# EAGLE design bathroom_fan_power_supply (EAGLE 9.6.2)
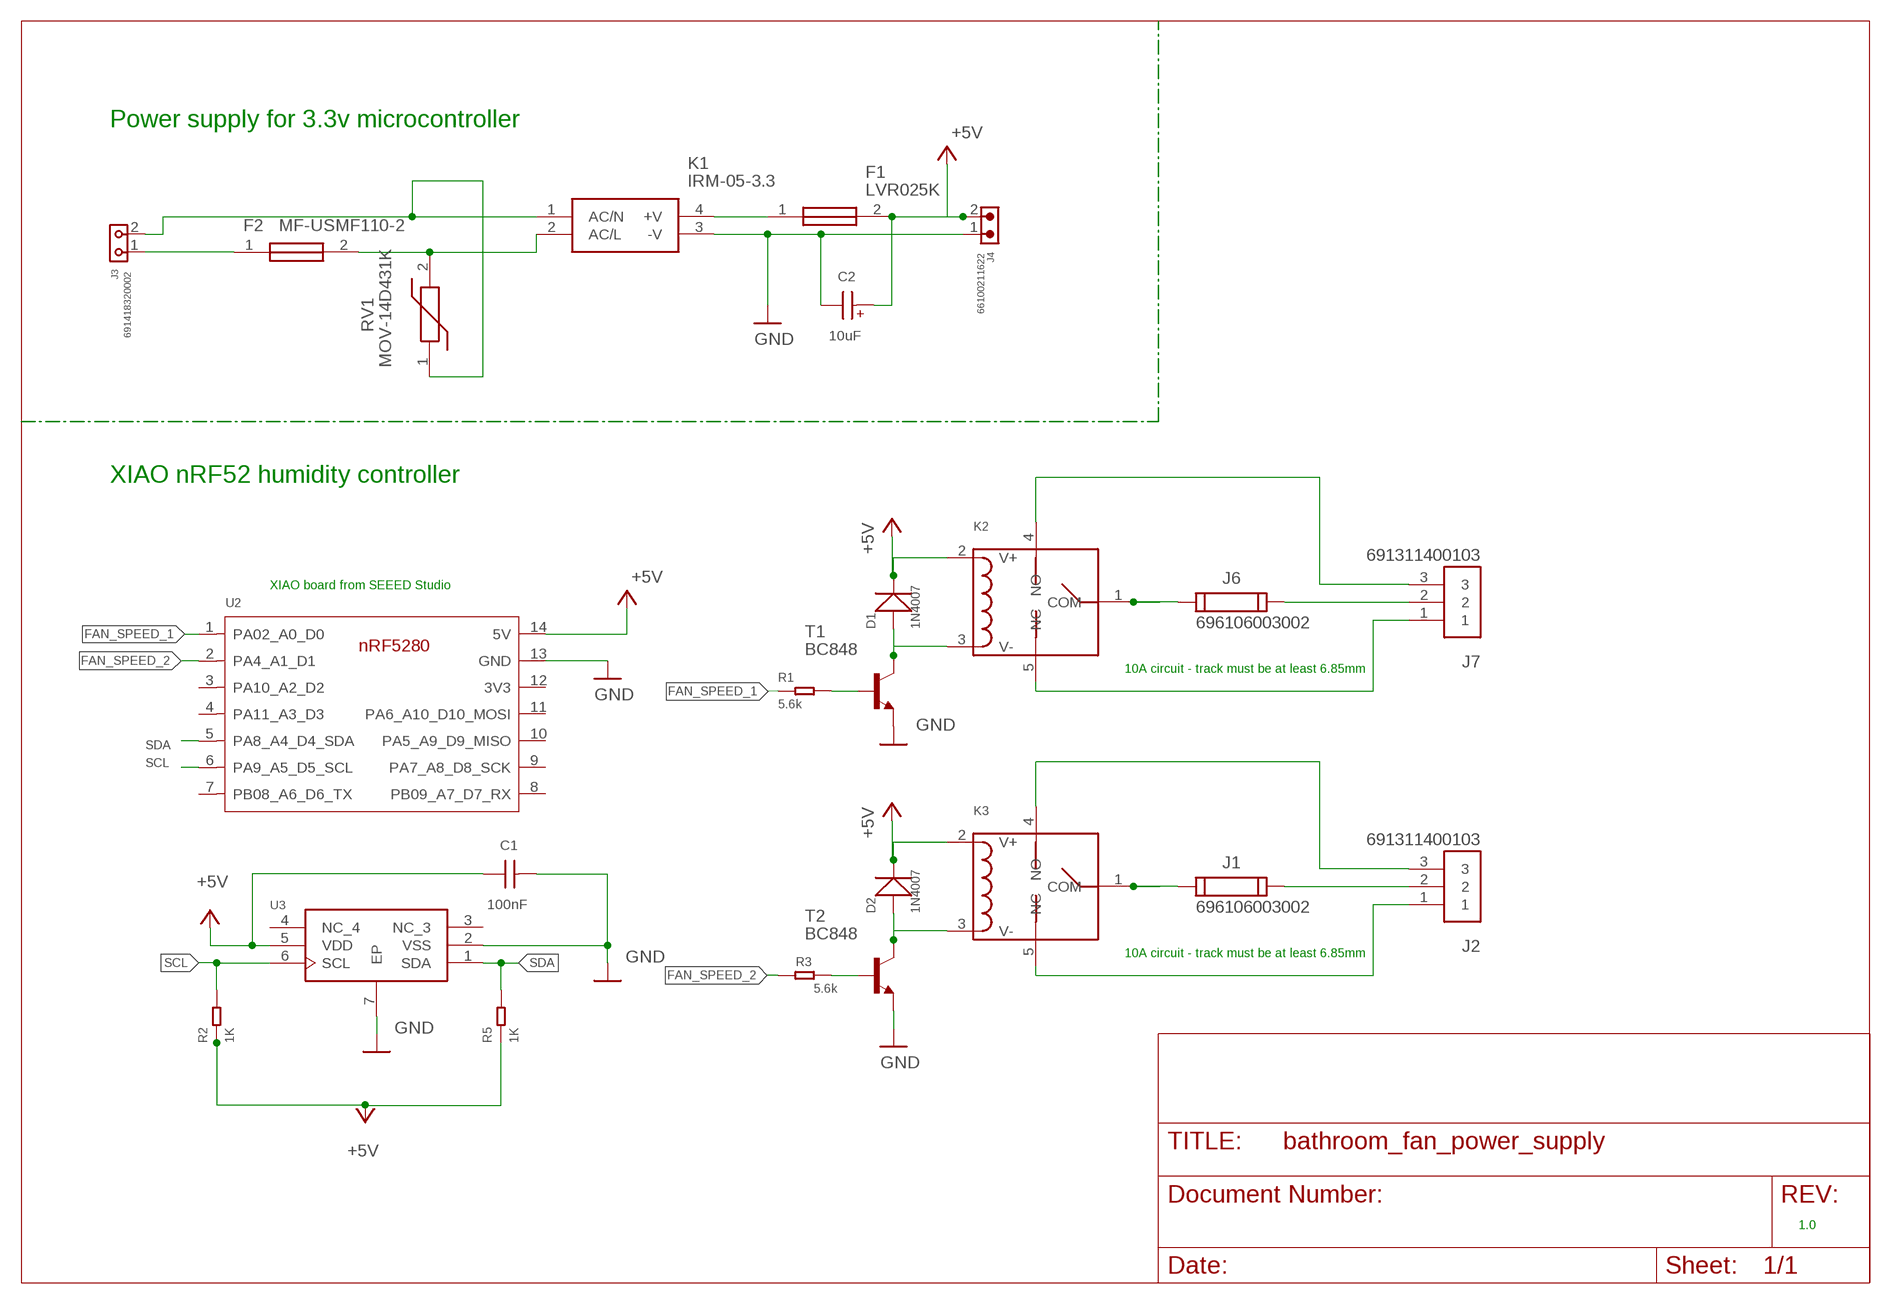
[diagram p0: schematic, sheet 1]

## Parts
C1  100nF  WCAP-CSGP_0805_H0.8_885012207016_10V(DC)_R  [WCAP-CSGP_0805_H0.8_R]
C2  10uF  WCAP-AS5H_4X5.5_865230340001  [WCAP-AS5H_4X5.5(DXL)]
D1  1N4007  DIODE-GEN-PURPOSE-1KV-1A(DO-214AC)  [DO-214AC]
D2  1N4007  DIODE-GEN-PURPOSE-1KV-1A(DO-214AC)  [DO-214AC]
F1  LVR025K  [LVR025K]
F2  MF-USMF110-2  [FUSC3226X85N]
J1  696106003002  [696106003002]
J2  691311400103  [TERMINALBLOCK_PLUGGABLE-3-7.62MM]
J3  691418320002  691418320002  [691418320002]
J4  66100211622  66100211622  [66100211622]
J6  696106003002  [696106003002]
J7  691311400103  [TERMINALBLOCK_PLUGGABLE-3-7.62MM]
K1  IRM-05-3.3  [IRM-05-3.3_1]
K2  HLS8L-DC3V-S-C  RELAY-HLS8L-DC5V-S-CHLS8L-DC5V-S-C  [REY5-19.0X15.0X15.0MM]
K3  HLS8L-DC3V-S-C  RELAY-HLS8L-DC5V-S-CHLS8L-DC5V-S-C  [REY5-19.0X15.0X15.0MM]
R1  5.6k  SMD-RES-5.6K-5%-1/8W(0805)  [R0805]
R2  1K  SMD-RES-5.6K-5%-1/8W(0805)  [R0805]
R3  5.6k  SMD-RES-5.6K-5%-1/8W(0805)  [R0805]
R5  1K  SMD-RES-5.6K-5%-1/8W(0805)  [R0805]
RV1  MOV-14D431K  [MOV-14D(5.2MM-T)]
T1  BC848  [SOT23]
T2  BC848  [SOT23]
U2  MOUDLE-SEEEDUINO-XIAO  [MOUDLE14P-2.54-21X17.8MM]
U3  SHT21  [6-TDFN]

## Nets
+5V: C1.1 C2.1(+) D1.2(-) D2.2(-) F1.2 J4.2 K2.2(V+) K3.2(V+) R2.1 R5.1 U2.14(5V) U3.5(VDD)
FAN_SPEED_1: R1.1 U2.1(PA02_A0_D0)
FAN_SPEED_2: R3.1 U2.2(PA4_A1_D1)
GND: C1.2 C2.2(-) J4.1 K1.3(-V) T1.2(E) T2.2(E) U2.13(GND) U3.2(VSS) U3.7(EP)
HIGHCURRENT1 [Power]: J1.1 K3.1(COM)
N$1: F2.2 K1.2(AC/L) RV1.2
N$2: F2.1 J3.1
N$3: F1.1 K1.4(+V)
N$4 [Power]: J6.1 K2.1(COM)
N$6: J3.2 K1.1(AC/N) RV1.1
N$7 [Power]: J6.2 J7.2
N$9: R1.2 T1.1(B)
N$11 [Power]: J7.1 K2.5(NC)
N$12 [Power]: J7.3 K2.4(NO)
N$14: D2.1(+) K3.3(V-) T2.3(C)
N$15: R3.2 T2.1(B)
N$16 [Power]: J2.1 K3.5(NC)
N$17 [Power]: J2.3 K3.4(NO)
N$18 [Power]: J1.2 J2.2
N$19: D1.1(+) K2.3(V-) T1.3(C)
SCL: R2.2 U2.6(PA9_A5_D5_SCL) U3.6(SCL)
SDA: R5.2 U2.5(PA8_A4_D4_SDA) U3.1(SDA)
Unconnected: U2.3(PA10_A2_D2) U2.4(PA11_A3_D3) U2.7(PB08_A6_D6_TX) U2.8(PB09_A7_D7_RX) U2.9(PA7_A8_D8_SCK) U2.10(PA5_A9_D9_MISO) U2.11(PA6_A10_D10_MOSI) U2.12(3V3) U3.3(NC_3) U3.4(NC_4)

## Notes on the sheet
- Power supply for 3.3v microcontroller
- XIAO nRF52 humidity controller
- XIAO board from SEEED Studio
- 10A circuit - track must be at least 6.85mm
- 10A circuit - track must be at least 6.85mm
- 1.0

## Library data of the parts
C1 = Wurth_Capacitors_WCAP-CSGP:WCAP-CSGP_0805_H0.8: WCAP-CSGP MLCCs 0805 Characteristics General purpose product series High performance ceramic High electrical precision and stability ceramic especially for NP0 Minimal aging especially for NP0 Mounting style: SMT-Chip Ceramic: NP0 (Class I), X5R (Class II), X7R (Class II) Temperature coefficient: ±30 ppm/°C; ±0.54 % for NP0 ±15 % for X5R and X7R Operating temperature: -55 °C up to + 125 °C for NP0 and X7R -55 °C up to + 85 °C for X5R Termination: Cu/Ni/Sn Recommended soldering: Reflow soldering Wave soldering for size 0603 Wave soldering for size 0805 (only valid for the thickness ≤0.85 mm) Applications Temperature compensation (NP0) Coupling Decoupling Bypass Smoothing Filtering Resonant circuit <https://www.we-online.com/catalog/media/o177837v209%20MLCC_GRP_all.jpg> Details see: https://www.we-online.com/catalog/en/pbs/capacitors/multilayer_ceramic_chip_capacitors/mlcc_general_purpose Updated by Ella Wu 2022-02-15 2022(C) Würth Elektronik; CERAMIC-TYPE: X7R Class II; DATASHEET-URL: https://www.we-online.com/redexpert/spec/885012207016?ae; DF: 5%; HEIGHT: 0.8mm; MOUNT: SMT; OPERATING-TEMPERATURE: -55 up to +125 °C; PART-NUMBER: 885012207016; QMIN: -; RISO: 5GOhm; SIZE: 0805; TECHNICAL-REFERENCE: X7R0805104K010DFCT10000; VR: 10V(DC)
C2 = Wurth_Capacitors_WCAP-AS5H:WCAP-AS5H_4X5.5: WCAP-AS5H Aluminium Electrolytic Capacitors Long Life +105 °C Characteristics Long life product series Mounting style: V-Chip SMT Capacitance range: 0.1 µF ‒ 1000 µF Capacitance tolerance: ±20 % Voltage range (UR): 6.3 ‒ 50 V(DC) Operating temperature: -40 °C up to +105 °C Endurance: 5000 h @ +105 °C Dimensions (DxL) in mm: 4.0 x 5.5 up to 10.0 x 10.5 Recommended soldering: Reflow soldering Applications Long life applications (industry, medical) Input and output capacitor for switched-mode power supply Filtering Smoothing e.g. DC/DC converter, AC/DC converter, satellite receiver, control panel <https://www.we-online.com/catalog/media/o55801v209%20Family_WCAP-AS5H.jpg> Details see: www.we-online.com/catalog/WCAP-AS5H <www.we-online.com/catalog/WCAP-AS5H/?utm_source=eagle_model&utm_medium=description_link&utm_campaign=eisos_eagle> Updated by Ella Wu 2022-07-27 2022(C) Würth Elektronik; DATASHEET-URL: https://www.we-online.com/redexpert/spec/865230340001?ae; DF: 22%; DIAMETER: 4mm; ENDURANCE: 5000h; HEIGHT: 5.5mm; I-LEAK: 3uA; I-RIPPLE: 17mA; OPERATING-TEMPERATURE: -40 °C up to +105 °C; PART-NUMBER: 865230340001; TECHNICAL-REFERENCE: ASDB055100M016DVCTAE000; VR: 16V(DC)
D1 D2 = OPL_Discrete_Semiconductor:DIODE-GEN-PURPOSE-1KV-1A(DO-214AC): 304010013; MPN: 1N4007
F1 = LVR025K:LVR025K: Fuse,resettable,PolySwitch,thermal and overcurrent protection,PCB mount,240Vac,250mA Source: Datasheet <https://componentsearchengine.com/Datasheets/1/LVR025K.pdf>; ARROW_PART_NUMBER: LVR025K; ARROW_PRICE-STOCK: https://www.arrow.com/en/products/lvr025k/littelfuse?region=europe; DESCRIPTION: Fuse,resettable,PolySwitch,thermal and overcurrent protection,PCB mount,240Vac,250mA; HEIGHT: 18.8mm; MANUFACTURER_NAME: LITTELFUSE; MANUFACTURER_PART_NUMBER: LVR025K; MOUSER_PART_NUMBER: 650-LVR025K; MOUSER_PRICE-STOCK: https://www.mouser.co.uk/ProductDetail/Littelfuse/LVR025K?qs=UrbseFuNL0k%252BoDJit06JJg%3D%3D
F2 = MF-USMF110-2:MF-USMF110-2: Bourns 1.1A Surface Mount Resettable Fuse, 6 V Source: Datasheet <https://www.arrow.com/en/products/mf-usmf110-2/bourns>; ARROW_PART_NUMBER: MF-USMF110-2; ARROW_PRICE-STOCK: https://www.arrow.com/en/products/mf-usmf110-2/bourns; DESCRIPTION: Bourns 1.1A Surface Mount Resettable Fuse, 6 V; HEIGHT: 0.85mm; MANUFACTURER_NAME: Bourns; MANUFACTURER_PART_NUMBER: MF-USMF110-2; MOUSER_PART_NUMBER: 652-MF-USMF110-2; MOUSER_PRICE-STOCK: https://www.mouser.co.uk/ProductDetail/Bourns/MF-USMF110-2?qs=9FzDyaD7ZFDRIi%252Bgh%252BHt3w%3D%3D
J1 J6 = Wurth_Connectors_WR-FSH:696106003002: WR-FSH Fuseholder THT Blocks PCB Clip Cover MATERIAL PROPERTIES Insulator Material PA66 Insulator Flammability Rating UL94 V-0 Insulator Color Green Contact Material Copper Alloy Contact Plating Tin over Nickel Contact Type Stamped GENERAL INFORMATION Operating Temperature -30 up to +120 °C Compliance RoHS ELECTRICAL PROPERTIES IR UL 20 A IR VDE 6.3 A Working Voltage [UL] 250 V (AC) Working Voltage [VDE] 250 V (AC) Withstanding Voltage [UL] 1500 V (AC) Withstanding Voltage [cULus] 1500 V (AC) Withstanding Voltage [VDE] 1500 V (AC) Contact Resistance 10 mΩ Contact Resistance [VDE] 10 mΩ MECHANICAL PROPERTIES Protection Class I & II Fuse Size 5x20 mm CERTIFICATION cULus Approval E157417 VDE Approval 129302 PACKAGING PROPERTIES Packaging Box <https://katalog.we-online.com/media/images/v2/o33102v209%20Family_WR-FSH_69610X003002.jpg> Details see: https://katalog.we-online.com/en/em/FSH_THT_PCB_CLIP_COVER_69610X003002 Updated by Ella Wu 2019-10-25 2019 (C) Wurth Elektronik; DATASHEET-URL: https://www.we-online.com/catalog/datasheet/696106003002.pdf; IR-UL: 20A; IR-VDE: 6.3A; MATES: 696122003001; PART-NUMBER: 696106003002
J2 J7 = Terminal Blocks:691311400103: 7.62MM CLOSE VERTICAL PCB HEADER WR-TBL Manufacturer's datasheet <https://katalog.we-online.com/em/datasheet/6913114001xx.pdf>; CREATED_BY: PCBLayout.com; DIGIKEY_PART_NO: 732-2824-ND; MANUFACTURER: WURTH ELEKTRONIK; MPN: 691311400103
J3 = Wurth_Connectors_WR-TBL Spring Clamp:691418320002: WR-TBL Serie 4183 - 3.81 mm 45° Cable Entry Screwless KIND PROPERTIES Pitch 3.81 mm MATERIAL PROPERTIES Insulator Material PA6/66 Insulator Flammability Rating UL94 V-0 Insulator Color Grey Contact Material Phosphor Bronze Contact Plating Matte Tin Wire Guard Material Phosphor Bronze GENERAL INFORMATION Operating Temperature -30 up to +120 °C Compliance Lead free / RoHS ELECTRICAL PROPERTIES IR UL 4 A IR VDE 4 A Working Voltage [UL] 300 V (AC) Working Voltage [VDE] 250 V (AC) Withstanding Voltage [UL] 1600 V (AC) Withstanding Voltage [VDE] 2000 V (AC) Contact Resistance 20 mΩ Mechanical Properties Wire Strip Length 7 (mm) Wire Properties Solid Wire Section (AWG) 16 to 30 (AWG) Solid Wire Section (Metric) 1.31 to 0.0509 (mm²) Stranded Wire Section (AWG) 16 to 30 (AWG) Stranded Wire Section (Metric) 1.31 to 0.0509 (mm²) CERTIFICATION UL Approval E150931 VDE Approval 40013441 Packaging Properties Packaging Box <https://www.we-online.com/catalog/media/o79471v209%20Family_WR-TBL_6914173200xxS_4C.jpg> Details see: https://www.we-online.com/catalog/en/TBL_3_81_4183_SCREWLESS_ANGLED_ENTRY_6914183200XX/ Updated by Ella Wu 2019-12-31 2019(C) Wurth Elektronik; DATASHEET-URL: https://www.we-online.com/catalog/datasheet/691418320002.pdf; IR-UL: 4A; IR-VDE: 4A; MOUNT: THT; PART-NUMBER: 691418320002; PINS: 2; PITCH: 3.81mm; TYPE: 45°; WIRE: 16 to 30 (AWG) 1.31 to 0.0509 (mm²); WORKING-VOLTAGE-UL: 300V (AC); WORKING-VOLTAGE-VDE: 250V (AC)
J4 = Wurth_Connectors_WR-WTB:66100211622: WR-WTB 2.54 mm Male Vertical Shrouded Header KIND PROPERTIES: Pitch:2.54 mm Gender:Male MATERIAL PROPERTIES: Insulator Material :PA46 Insulator Flammability Rating:UL94 V-0 Color:Black Contact Material:Phosphor Bronze Contact Plating:Tin GENERAL INFORMATION Operating Temperature:-40 up to +105 °C Compliance: RoHS Working Voltage:50 V (AC) Withstanding Voltage:500 V (AC) Contact Resistance:20 mΩ PACKAGING PROPERTIES Packaging:Box <https://katalog.we-online.com/media/images/v2/o58903v209%20Family_WR-WTB_6610xx11622_2%2054.jpg> Details see: https://katalog.we-online.com/en/em/WTB_2_54_MALE_VERTICAL_SHROUDED_HEADER_GLOW_WIRE_PLASTIC_6610XXX1622 Updated by Yingchun,Shan 2019-11-05 2019 (C) Würth Elektronik; CONTACT-RESISTANCE: 20mOhm; DATASHEET-URL: https://www.we-online.com/catalog/datasheet/66100211622.pdf; GENDER: Male; IR: 3A; L: 4.78mm; MOUNT: THT; PACKAGING: Box; PART-NUMBER: 66100211622; PCB-CABLE-PANEL: PCB; PINS: 2; PITCH: 2.54mm; TOL-R: max.; TYPE: Vertical; WORKING-VOLTAGE: 50V(AC)
K1 = IRM-05-3.3:IRM-05-3.3: AC/DC Power Modules 3.3V 1.25A 4.125W 85-264Vin Encap PS Source: Datasheet <https://www.meanwell-web.com/content/files/pdfs/productPdfs/MW/IRM-05-spec.pdf>; ARROW_PART_NUMBER: IRM-05-3.3; ARROW_PRICE-STOCK: https://www.arrow.com/en/products/irm-05-3.3/mean-well-enterprises?region=nac; DESCRIPTION: AC/DC Power Modules 3.3V 1.25A 4.125W 85-264Vin Encap PS; HEIGHT: mm; MANUFACTURER_NAME: Mean Well; MANUFACTURER_PART_NUMBER: IRM-05-3.3; MOUSER_PART_NUMBER: 709-IRM05-3.3; MOUSER_PRICE-STOCK: https://www.mouser.co.uk/ProductDetail/MEAN-WELL/IRM-05-3.3?qs=WkdRfq4wf1MOEinwvhZEjA%3D%3D
K2 K3 = OPL_Relay:RELAY-HLS8L-DC5V-S-C: 315030000
R1 R3 = OPL_Resistor:SMD-RES-5.6K-5%-1/8W(0805): 301012204; MPN: RC0805JR-071KL; VALUE: 1K
R2 R5 = OPL_Resistor:SMD-RES-5.6K-5%-1/8W(0805): 301012204; MPN: RC0805JR-071KL
RV1 = MOV-14D431K:MOV-14D431K: Varistor;Metal Oxide;14 mm;430V;10% Bourns MOV-14D Series Metal Oxide Varistor 460pF 50A 710V Source: Datasheet <https://componentsearchengine.com/Datasheets/1/MOV-14D431K.pdf>; ARROW_PART_NUMBER: MOV-14D431K; ARROW_PRICE-STOCK: https://www.arrow.com/en/products/mov-14d431k/bourns; DESCRIPTION: Varistor;Metal Oxide;14 mm;430V;10% Bourns MOV-14D Series Metal Oxide Varistor 460pF 50A 710V; HEIGHT: mm; MANUFACTURER_NAME: Bourns; MANUFACTURER_PART_NUMBER: MOV-14D431K; MOUSER_PART_NUMBER: 652-MOV-14D431K; MOUSER_PRICE-STOCK: https://www.mouser.co.uk/ProductDetail/Bourns/MOV-14D431K?qs=CQ3B1E%252BbPs0oqNHNiUHWVg%3D%3D
T1 T2 = transistor-neu-to92:BC848: NPN TRANSISTOR
U2 = XIAO nRF52840:MOUDLE-SEEEDUINO-XIAO
U3 = Sensor:SHT21: SENSOR HUMID/TEMP 3V I2C 2% SMD Manufacturer's datasheet <https://www.sensirion.com/fileadmin/user_upload/customers/sensirion/Dokumente/0_Datasheets/Humidity/Sensirion_Humidity_Sensors_SHT21_Datasheet.pdf>; CREATED_BY: PCBLayout.com; DIGIKEY_PART_NUMBER: 1649-1005-1-ND; MANUFACTURER: Sensirion AG; MPN: SHT21; PACKAGE: 6-TDFN

## Net classes
1 Power: width 0.007 mm

## Board
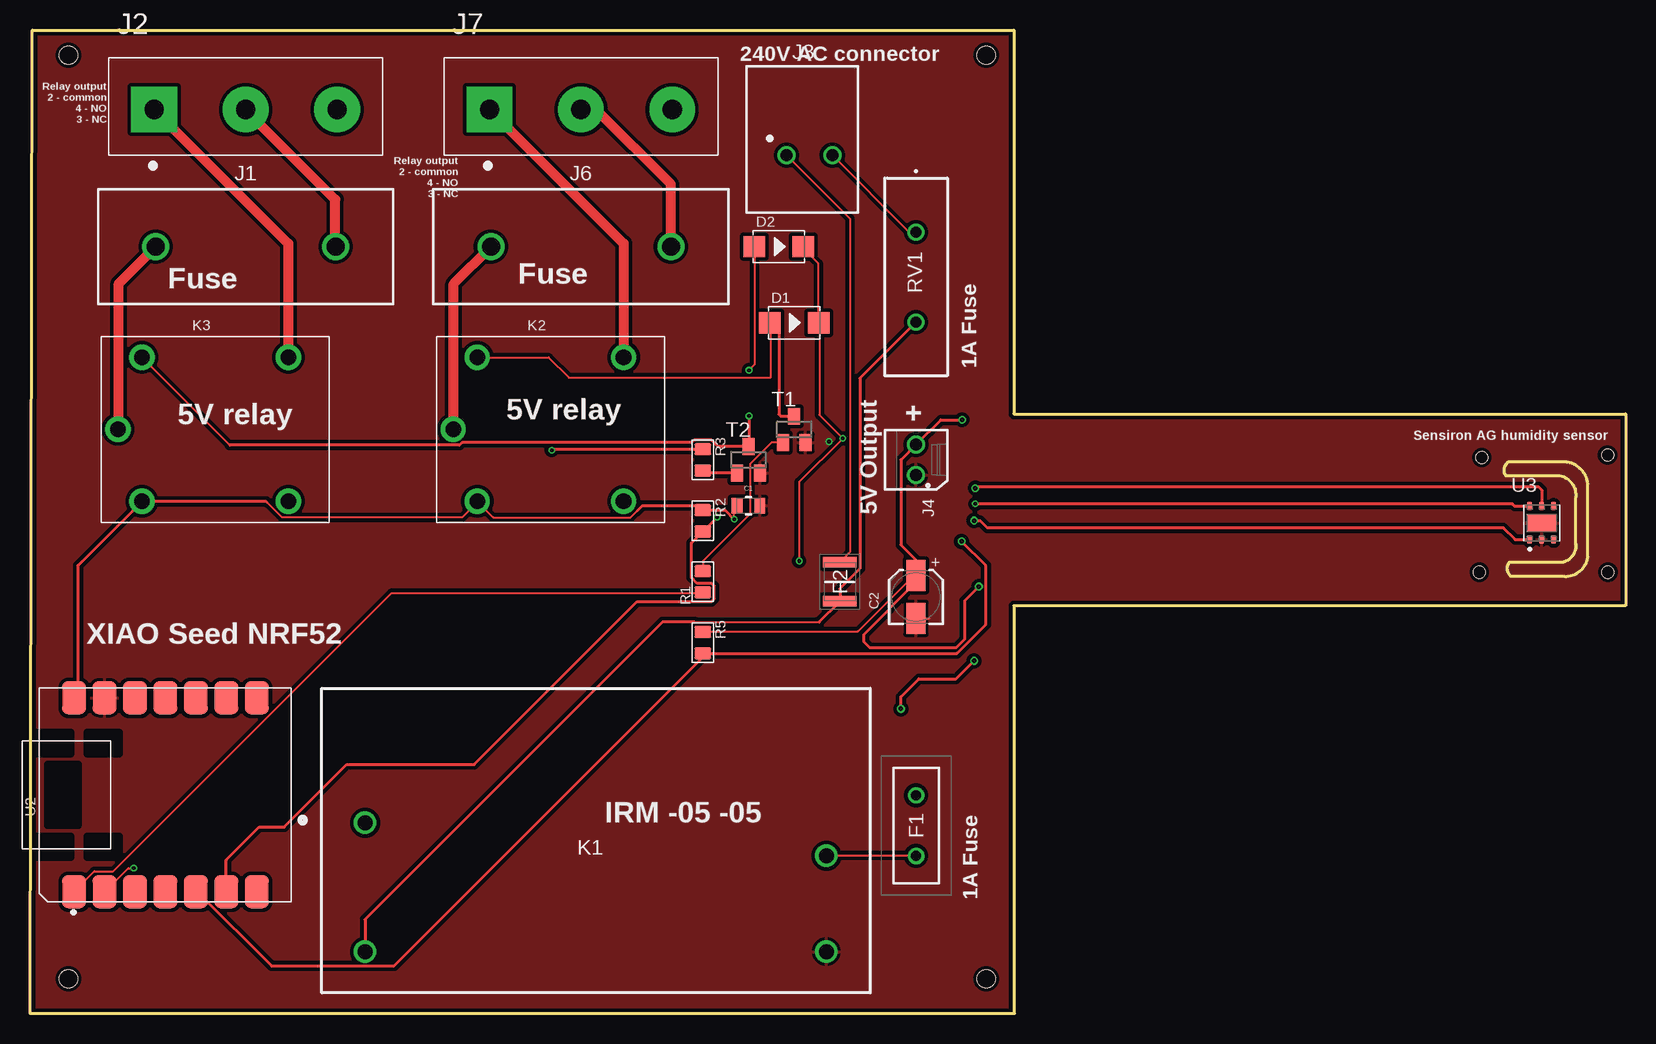
[diagram p1: board, top side]
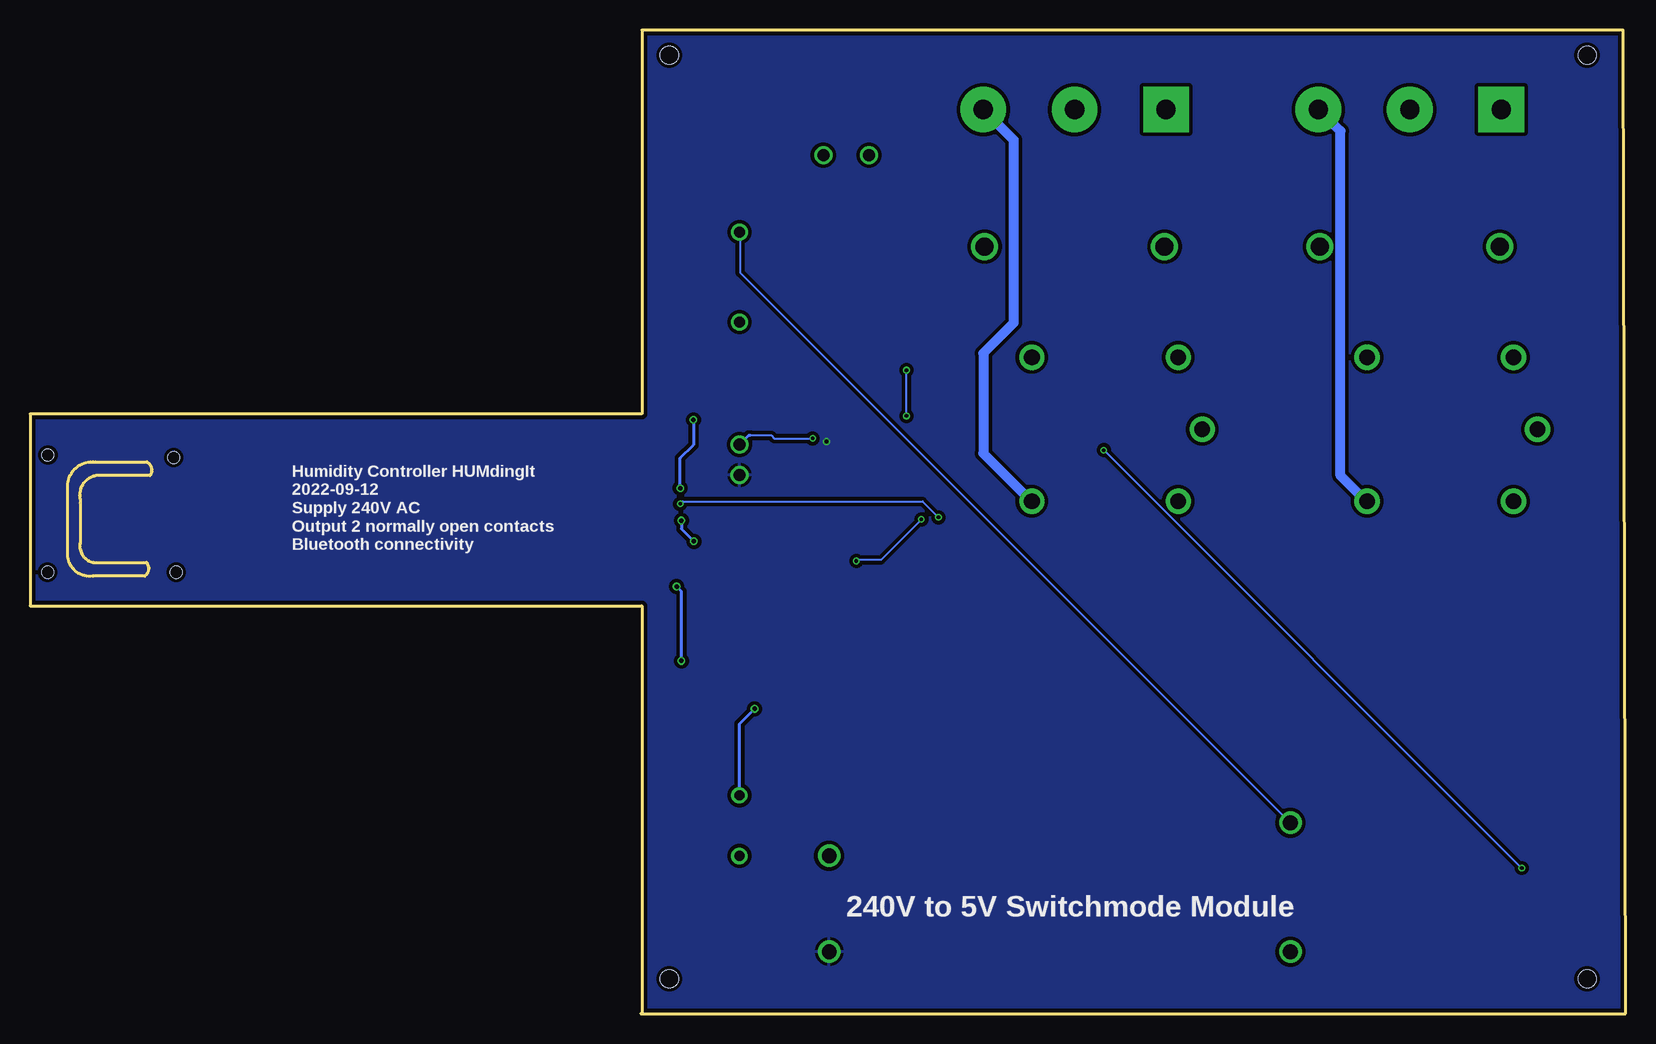
[diagram p2: board, bottom side, seen from below]

Size 133 x 82 mm. Coordinates in mm from the lower left corner, seen from the top.
Outline: 0,0 0.2,82 82,82 82,50 133,50 133,34 82,34 82,0.1 82.1,0 0,0
Copper layers (1*16): Top 0.035mm / dielectric 1.5mm / Bottom 0.035mm
Design rules "SparkFun-2-Layer-Minimum-JLCPCB": minimum track width 5mil, minimum drill 0.3mm, track to track 5mil, track to pad 5mil, pad to pad 5mil, via to via 5mil, smd to smd 5mil, copper to edge 7mil, drill to drill 7mil, minimum pad ring 5mil, minimum via ring 5mil, stop-mask expansion 2.5mil, vias tented up to drill 25mil, thermal gap 10mil
Holes 1.5 mm at 3.2,79.9 79.7,79.9 3.2,2.9 79.7,2.9
Holes 1 mm at 121.02,46.36 120.82,36.79 131.53,36.79 131.51,46.57
Milling: 13 lines

### Footprints (pad centres in the part's own frame; a part is rotated, then mirrored left to right if it is on the bottom)
WCAP-CSGP_0805_H0.8_R = smd 0.9 x 1.3: 1 -0.95,0; 2 0.95,0
WCAP-AS5H_4X5.5(DXL) = smd 2.6 x 1.6: 1 1.8,0; 2 -1.8,0
DO-214AC = smd 1.8 x 1.77: 1 -2.042,0; 2 2.042,0
LVR025K = drill 0.84 pad 1.365: 1 0,0; 2 5.05,0
FUSC3226X85N = smd 0.88 x 2.81: 1 -1.635,0; 2 1.635,0
696106003002 = drill 1.5: 1 -7.5,0; 2 7.5,0
TERMINALBLOCK_PLUGGABLE-3-7.62MM = drill 1.6 pad 3.81 square: 1 -7.62,0 | drill 1.6 pad 3.81: 2 0,0; 3 7.62,0
691418320002 = drill 1: 1 -1.905,0; 2 1.905,0
66100211622 = drill 1: 1 1.27,0; 2 -1.27,0
IRM-05-3.3_1 = drill 1.24 pad 1.89: 1 3.6,14.2; 2 3.6,3.45; 3 42.05,3.45; 4 42.05,11.45
REY5-19.0X15.0X15.0MM = drill 1.3 pad 2.1: 1 -8.1,0; 2 -6.1,-6; 3 -6.1,6; 4 6.1,-6; 5 6.1,6
R0805 = smd 1.397 x 1.016: 1 0,0.889; 2 0,-0.889
MOV-14D(5.2MM-T) = drill 0.9 pad 1.4: 1 -3.75,0; 2 3.75,0
SOT23 = smd 1 x 1.4: 1 -0.95,-1.1; 2 0.95,-1.1; 3 0,1.1
MOUDLE14P-2.54-21X17.8MM = smd 2.75 x 2: 1 0.835,18.12; 2 0.835,15.58; 3 0.835,13.04; 4 0.835,10.5; 5 0.835,7.96; 6 0.835,5.42; 7 0.835,2.88; 8 17,2.88; 9 17,5.42; 10 17,7.96; 11 17,10.5; 12 17,13.04; 13 17,15.58; 14 17,18.12
6-TDFN = smd 0.43 x 0.71: 1 -1,-1.4; 2 0,-1.4; 3 1,-1.4; 4 1,1.4; 5 0,1.4; 6 -1,1.4 | smd 2.4 x 1.5: 7 0,0

### Placement (x,y rotation side)
C1  59.89,42.35 0 top
C2  73.86,34.73 90 top
D1  63.7,57.59 0 top
D2  62.43,63.94 0 top
F1  73.86,13.14 90 top
F2  67.51,36 270 top
J1  17.98,63.94 0 top
J2  17.98,75.37 0 top
J3  64.97,71.56 0 top
J4  73.86,46.16 270 top
J6  45.92,63.94 0 top
J7  45.92,75.37 0 top
K1  24.33,1.71 0 top
K2  43.38,48.7 0 top
K3  15.44,48.7 0 top
R1  56.08,36 180 top
R2  56.08,41.08 0 top
R3  56.08,46.16 0 top
R5  56.08,30.92 0 top
RV1  73.86,61.4 270 top
T1  63.7,48.7 0 top
T2  59.89,46.16 0 top
U2  21.79,9.33 90 top
U3  126.01,40.91 0 top

### Tracks (layer width: path | path; a pad name or v marks a point on that pad's centre or on a via)
+5V  (via drill 0.3, 0.38)
  Top 0.178: C1.1 58.7,42.35 v58.7,41.19 | 50.61,41.91 50.07,41.37 38.6,41.37 37.36,42.62 | 19.76,42.62 21,41.37 36.03,41.37 37.27,42.62 | 65.72,57.64 65.72,62.53 64.47,63.77 | 56.12,31.86 69.01,31.86 73.72,36.57 | 65.81,57.55 65.81,49.91 v67.76,47.95 64.12,44.31 v64.12,37.73
  Top 0.254: 50.61,41.91 51.05,42.35 55.7,42.35 R2.1 57.92,41.97 v58.7,41.19 | J4.2 72.59,46.16 72.59,39.07 73.86,37.8 C2.1 | 65.72,57.64 65.72,57.61 D1.2 65.77,57.59 65.81,57.55 | 37.27,42.62 37.28,42.62 K2.2 37.36,42.62 | R5.1 56.12,31.85 56.12,31.86 | D2.2 64.47,63.77 | C2.1 73.76,36.53 73.72,36.57 | U2.14 4.01,26.67 4.01,37.37 K3.2 19.68,42.7 19.76,42.62 | J4.2 73.49,47.06 | v72.6,25.4 72.6,26.4 74.1,27.9 77.2,27.9 v78.7,29.4 | v79.1,35.6 77.9,34.4 77.9,31.2 77.2,30.5 70,30.5 69.5,31 69.5,31.6 73.86,35.96 C2.1 | J4.2 75.93,49.5 v77.7,49.5 | v78.8,43.8 78.9,43.9 125.76,43.9 126.01,43.65 U3.5
  Bottom 0.178: v58.7,41.19 62.07,37.82 64.12,37.82 v64.12,37.73 | v67.76,47.95 70.96,47.95 71.2,48.19 72.95,48.19
  Bottom 0.254: 72.95,48.19 73.1,48.19 J4.2 | F1.2 73.86,24.14 v72.6,25.4 | v78.7,29.4 78.7,35.2 v79.1,35.6 | v77.7,49.5 77.7,47.4 78.8,46.3 v78.8,43.8
FAN_SPEED_1
  Top 0.178: R1.1 56.03,35.06 30.16,35.06 6.96,11.86 5.36,11.86 U2.1
FAN_SPEED_2  (via drill 0.3)
  Top 0.178: v8.65,12.12 8.2,12.12 6.24,10.16 U2.2
  Top 0.254: v43.49,46.97 43.57,47.05 R3.1
  Bottom 0.178: v8.65,12.12 v43.49,46.97
GND  (via drill 0.3)
  Top 0.178: 73.9,32.93 74.97,32.93
  Top 0.254: T2.2 60.84,44.89 | 64.74,47.68 64.73,47.68 T1.2 64.3,47.59 | C2.2 73.89,32.93 73.9,32.93
  other vias: 66.61,47.68
  pour Top (isolate 0.305): 0.2,81.8 81.8,81.8 81.8,49.7 132.8,49.7 132.8,34.4 81.8,34.4 81.8,0.2 0.2,0.2
  pour Bottom (isolate 0.305): 0.2,81.8 81.9,81.8 81.9,49.7 132.8,49.7 132.8,34.2 81.8,34.2 81.8,0.2 0.2,0.2
HIGHCURRENT1
  Top 0.254: K3.1 7.39,48.75 7.4,48.75 | 7.4,60.84 7.4,60.86
  Top 0.813: 7.4,48.75 7.4,60.84 | 7.4,60.86 J1.1
N$1
  Top 0.178: 55.38,32.63 65.78,32.63
  Top 0.254: RV1.2 69.17,52.96 69.17,37.09 67.51,35.43 F2.2 65.78,32.63 | 55.38,32.63 52.72,32.63 27.93,7.85 K1.2
N$2
  Top 0.178: J3.1 68.36,66.27 68.36,38.48 F2.1
N$3
  Top 0.178: 66.43,13.19 73.81,13.19 F1.1
  Top 0.254: K1.4 66.41,13.19 66.43,13.19
N$4
  Top 0.254: K2.1 35.32,48.74 35.32,48.75 | J6.1 38.34,63.86
  Top 0.813: 35.32,48.75 35.32,60.84 38.34,63.86
N$6
  Top 0.178: RV1.1 73.81,65.2 73.24,65.2 J3.2
  Bottom 0.178: RV1.1 73.81,65.1 73.81,61.79 K1.1
N$7
  Top 0.813: J6.2 53.42,69.14 47.19,75.37 J7.2
N$9
  Top 0.178: 62.52,47.59 61.81,47.59 60.03,45.82 60.03,41.64 56.12,37.73 56.12,36.93 R1.2
  Top 0.254: T1.1 62.52,47.6 62.52,47.59
N$11
  Top 0.254: 49.45,64.22 49.48,64.19
  Top 0.813: J7.1 49.45,64.22 | 49.48,64.19 K2.5
N$12
  Bottom 0.254: 49.53,42.7 K2.4
  Bottom 0.813: 49.53,42.7 53.54,46.71 53.54,55.05 51,57.59 51,72.83 J7.3
N$14  (via drill 0.3)
  Top 0.178: 59.94,47.43 59.94,47.33 | 60.38,63.86 60.38,54.09 v59.94,53.64 | 16.66,47.38 K3.3
  Top 0.254: 16.66,47.38 35.81,47.38 36.01,47.59 55.13,47.59 55.35,47.81 56.81,47.81 57.36,47.26 T2.3 59.89,47.28 59.94,47.33 | D2.1 60.39,63.87 60.38,63.86 | v59.94,49.82 59.94,47.43
  Bottom 0.178: v59.94,49.82 v59.94,53.64
N$15
  Top 0.254: T2.1 56.29,45.06 R3.2
N$16
  Top 0.813: J2.1 21.54,64.19 K3.5
N$17
  Bottom 0.254: 21.62,42.7 K3.4 | 25.57,75.37 J2.3
  Bottom 0.813: 21.62,42.7 23.77,44.85 23.77,73.57 25.57,75.37
N$18
  Top 0.178: 17.98,75.33 J2.2
  Top 0.254: J1.2 25.46,63.94 25.45,63.95
  Top 0.813: 25.45,63.95 25.45,67.86 17.98,75.33
N$19
  Top 0.178: K2.3 43.23,54.7 44.92,53.02 61.72,53.02 61.72,57.53 D1.1
  Top 0.254: D1.1 62.43,57.59 62.43,49.97 62.6,49.8 T1.3
SCL  (via drill 0.3)
  Top 0.254: v57.27,41.37 56.09,40.19 R2.2 55.13,39.24 55.13,36.35 55.6,35.87 56.81,35.87 57.03,35.65 57.03,34.57 56.81,34.35 50.62,34.35 37.03,20.76 26.41,20.76 21.21,15.55 19.12,15.55 16.37,12.8 U2.6 | v78.8,42.49 123.58,42.49 123.76,42.31 U3.6
  Bottom 0.178: v78.8,42.49 78.6,42.69 58.6,42.69 v57.27,41.37
SDA  (via drill 0.38)
  Top 0.254: U2.5 13.93,10.16 20.13,3.96 30.34,3.96 56.08,29.7 R5.2 77.27,30.03 79.67,32.43 79.67,37.35 v77.66,39.36 | U3.1 123.81,39.51 122.82,40.5 79.8,40.5 79.2,41.1 v78.7,41.1
  Bottom 0.254: v78.7,41.1 78.7,40.4 v77.66,39.36

### Text on the board
bPlace: Humidity Controller HUMdingIt / 2022-09-12 / Supply 240V AC / Output 2 normally open contacts / Bluetooth connectivity | 240V to 5V Switchmode Module
top_silk: 240V AC connector | Relay output / 2 - common / 4 - NO / 3 - NC | Relay output / 2 - common / 4 - NO / 3 - NC | Fuse | Fuse | 1A Fuse | 5V relay | 5V relay | + | Sensiron AG humidity sensor | 5V Output | XIAO Seed NRF52 | IRM -05 -05 | 1A Fuse
silktop: Cut -> / option | <- Cut / option
DrillLegend: LAYER-STACK
DrillLegend_01-16: 01-16